# EAGLE design main (EAGLE 9.6.2)
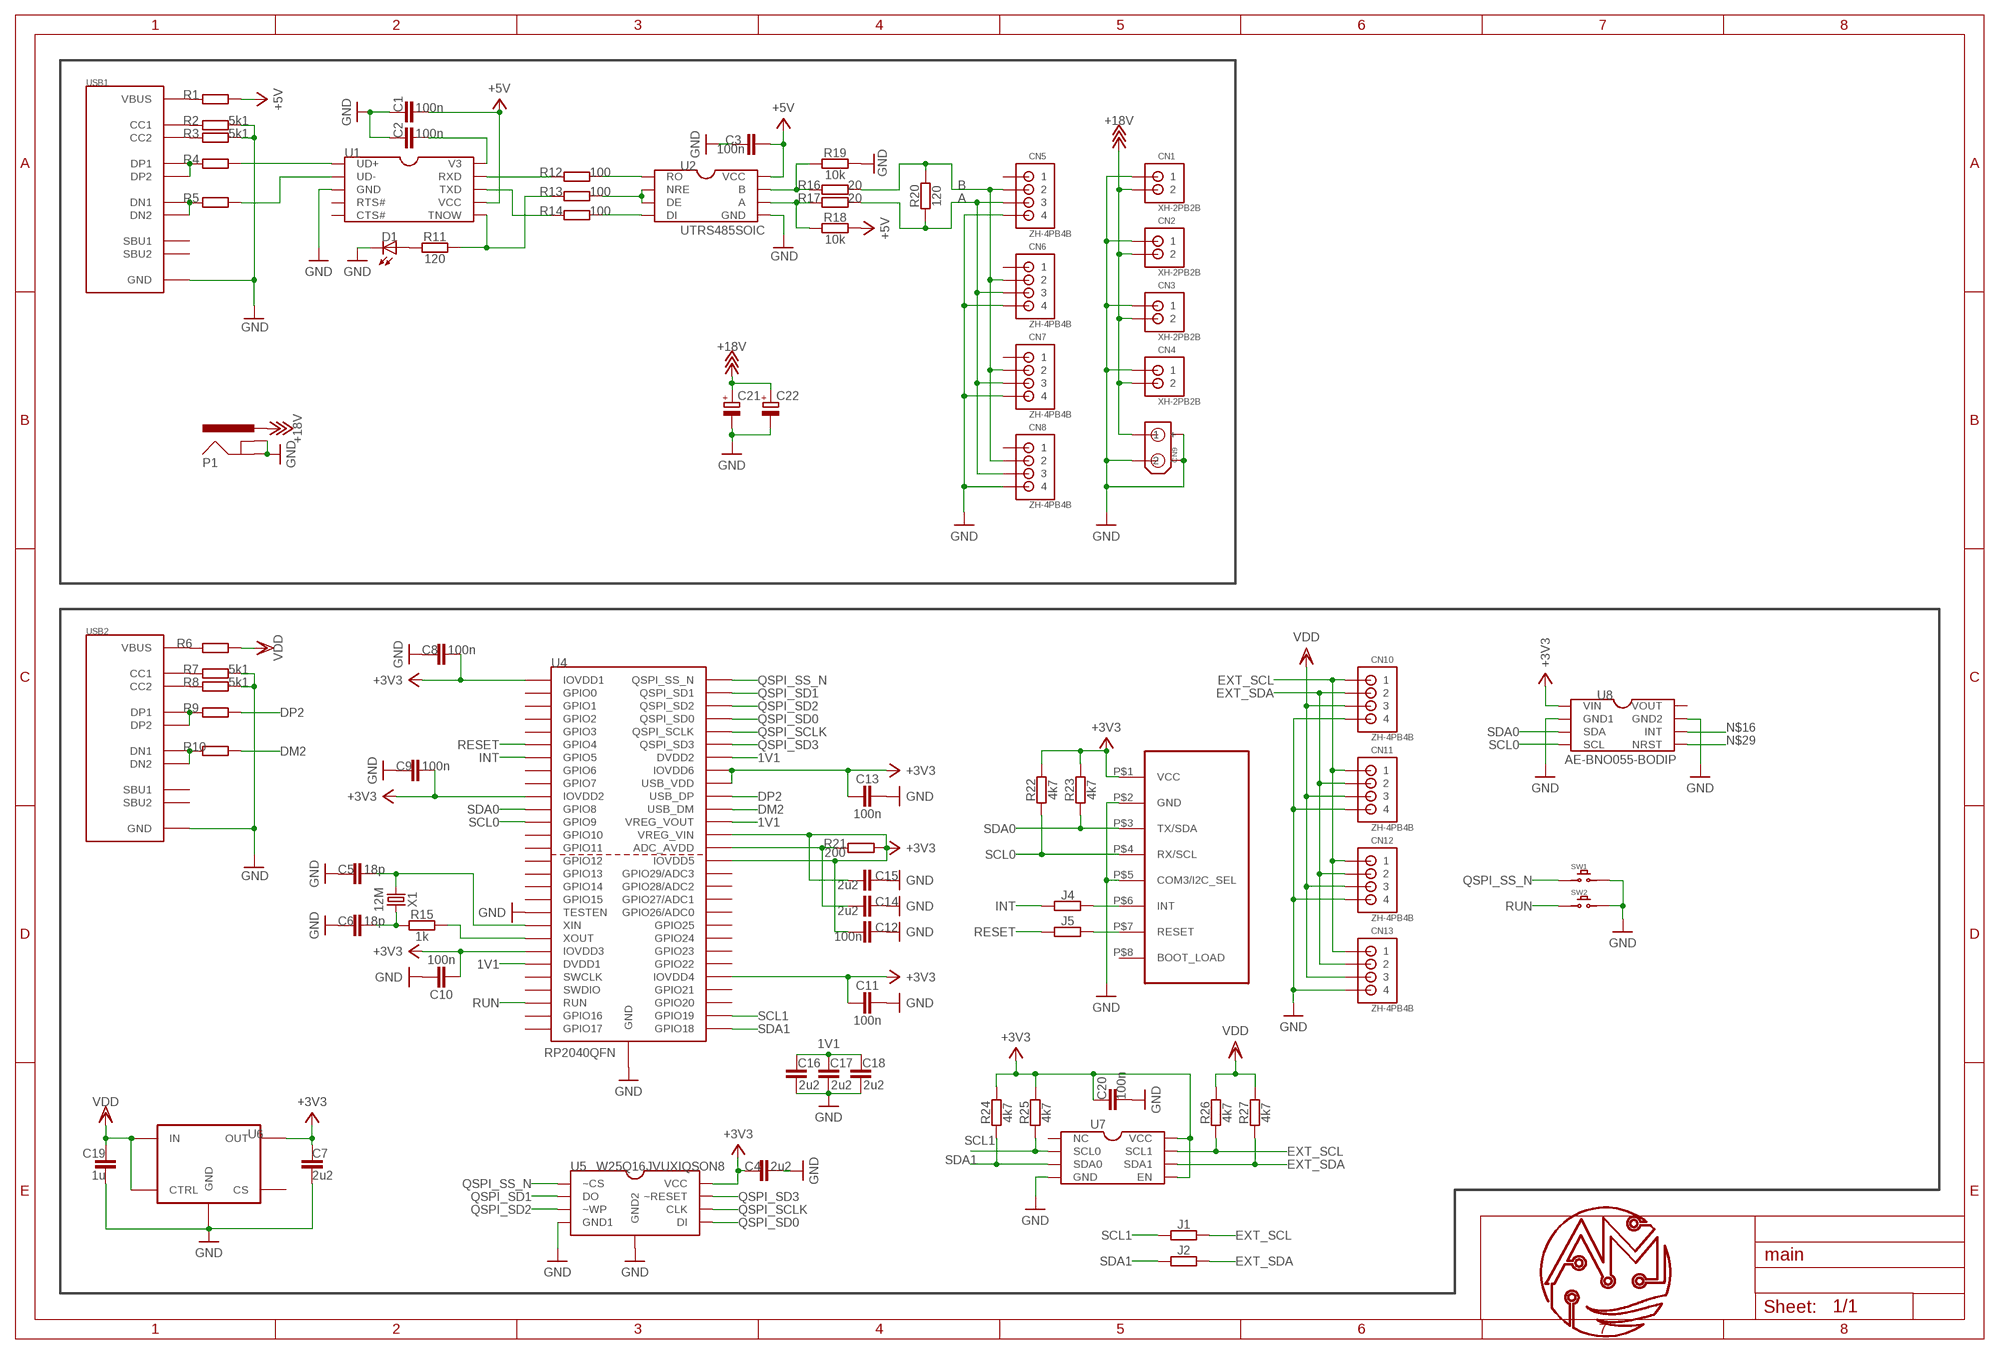
[diagram p0: schematic, sheet 1]

## Parts
C1  100n  CAPACITOR1608  [C1608]
C2  100n  CAPACITOR1608  [C1608]
C3  100n  CAPACITOR1608  [C1608]
C4  2u2  CAPACITOR1608  [C1608]
C5  18p  CAPACITOR1608  [C1608]
C6  18p  CAPACITOR1608  [C1608]
C7  2u2  CAPACITOR1608  [C1608]
C8  100n  CAPACITOR1608  [C1608]
C9  100n  CAPACITOR1608  [C1608]
C10  100n  CAPACITOR1608  [C1608]
C11  100n  CAPACITOR1608  [C1608]
C12  100n  CAPACITOR1608  [C1608]
C13  100n  CAPACITOR1608  [C1608]
C14  2u2  CAPACITOR1608  [C1608]
C15  2u2  CAPACITOR1608  [C1608]
C16  2u2  CAPACITOR1608  [C1608]
C17  2u2  CAPACITOR1608  [C1608]
C18  2u2  CAPACITOR1608  [C1608]
C19  1u  CAPACITOR1608  [C1608]
C20  100n  CAPACITOR1608  [C1608]
C21  E_CAPACITORRADIAL_D8  [ECAP-D80-L115]
C22  E_CAPACITORRADIAL_D8  [ECAP-D80-L115]
CN1  XH-2PB2B  [B2B-XH-A]
CN2  XH-2PB2B  [B2B-XH-A]
CN3  XH-2PB2B  [B2B-XH-A]
CN4  XH-2PB2B  [B2B-XH-A]
CN5  ZH-4PB4B  [B4B-ZR]
CN6  ZH-4PB4B  [B4B-ZR]
CN7  ZH-4PB4B  [B4B-ZR]
CN8  ZH-4PB4B  [B4B-ZR]
CN9  XT60PW-MPCB  [XT60PW-M]
CN10  ZH-4PB4B  [B4B-ZR]
CN11  ZH-4PB4B  [B4B-ZR]
CN12  ZH-4PB4B  [B4B-ZR]
CN13  ZH-4PB4B  [B4B-ZR]
D1  LED1608R  [LED1608R]
J1  JUMPER1608  [J1608]
J2  JUMPER1608  [J1608]
J4  JUMPER1608  [J1608]
J5  JUMPER1608  [J1608]
P1  DC-JACKMJ179PH  [MJ179PH]
R1  RESISTER3225  [R3225]
R2  5k1  RESISTER1608  [R1608]
R3  5k1  RESISTER1608  [R1608]
R4  RESISTER1608  [R1608]
R5  RESISTER1608  [R1608]
R6  RESISTER3225  [R3225]
R7  5k1  RESISTER1608  [R1608]
R8  5k1  RESISTER1608  [R1608]
R9  RESISTER1608  [R1608]
R10  RESISTER1608  [R1608]
R11  120  RESISTER1608  [R1608]
R12  100  RESISTER1608  [R1608]
R13  100  RESISTER1608  [R1608]
R14  100  RESISTER1608  [R1608]
R15  1k  RESISTER1608  [R1608]
R16  20  RESISTER1608  [R1608]
R17  20  RESISTER1608  [R1608]
R18  10k  RESISTER1608  [R1608]
R19  10k  RESISTER1608  [R1608]
R20  120  RESISTER1608  [R1608]
R21  200  RESISTER1608  [R1608]
R22  4k7  RESISTER1608  [R1608]
R23  4k7  RESISTER1608  [R1608]
R24  4k7  RESISTER1608  [R1608]
R25  4k7  RESISTER1608  [R1608]
R26  4k7  RESISTER1608  [R1608]
R27  4k7  RESISTER1608  [R1608]
SW1  TSY3420SMD-HOLE  [TSY3420-HOLE]
SW2  TSY3420SMD-HOLE  [TSY3420-HOLE]
U1  CH340EMSOP  [MSOP-05-10P]
U2  UTRS485SOIC  [SOIC-8P]
U3  CJMCU-055SIP  [CJMCU-055]
U4  RP2040QFN  [RP2040]
U5  W25Q16JVUXIQSON8  [W25Q16JVUXIQ]
U6  REGULATOR2SOT23-5P  [SOT23-5P]
U7  PCA9515SOIC  [PCA9515-SOIC]
U8  AE-BNO055-BODIP  [AE-BNO055-BO]
U$2  LOGO8MM  [LOGO-8MM]
USB1  USB-CSMD  [5077CR-16-SMC2-BK-TR]
USB2  USB-CSMD  [5077CR-16-SMC2-BK-TR]
X1  12M  XTALHC49S  [HC49S]

## Nets
1V1: C16.P$1 C17.P$1 C18.P$1 U4.P$23(DVDD1) U4.P$45(VREG_VOUT) U4.P$50(DVDD2)
+3V3: C4.P$1 C7.P$2 C8.P$2 C9.P$2 C10.P$2 C11.P$2 C12.P$2 C13.P$1 C15.P$2 C20.P$1 R21.P$2 R22.P$2 R23.P$2 R24.P$2 R25.P$2 U3.P$1(VCC) U4.P$1(IOVDD1) U4.P$10(IOVDD2) U4.P$22(IOVDD3) U4.P$33(IOVDD4) U4.P$42(IOVDD5) U4.P$44(VREG_VIN) U4.P$48(USB_VDD) U4.P$49(IOVDD6) U5.P$8(VCC) U6.P$5(OUT) U7.P$5(EN) U7.P$8(VCC) U8.P$1(VIN)
+5V: C1.P$2 C3.P$1 R1.P$2 R18.P$1 U1.P$7(VCC) U2.P$8(VCC)
+18V: C21.+ C22.+ CN1.2 CN2.2 CN3.2 CN4.2 CN9.P$1(+) P1.VCC1(PWR) P1.VCC(PWR)
A: CN5.3 CN6.3 CN7.3 CN8.3 R17.P$1 R20.P$2
B: CN5.2 CN6.2 CN7.2 CN8.2 R16.P$1 R20.P$1
DM2: R10.P$2 U4.P$46(USB_DM)
DP2: R9.P$2 U4.P$47(USB_DP)
EXT_SCL: CN10.1 CN11.1 CN12.1 CN13.1 J1.P$2 R26.P$1 U7.P$7(SCL1)
EXT_SDA: CN10.2 CN11.2 CN12.2 CN13.2 J2.P$2 R27.P$1 U7.P$6(SDA1)
GND: C1.P$1 C2.P$1 C3.P$2 C4.P$2 C5.P$1 C6.P$1 C7.P$1 C8.P$1 C9.P$1 C10.P$1 C11.P$1 C12.P$1 C13.P$2 C14.P$1 C15.P$1 C16.P$2 C17.P$2 C18.P$2 C19.P$1 C20.P$2 C21.- C22.- CN1.1 CN2.1 CN3.1 CN4.1 CN5.4 CN6.4 CN7.4 CN8.4 CN9.P$2(-) CN9.P$3(-1) CN9.P$4(-2) CN9.P$5(-1) CN9.P$6(-2) CN10.4 CN11.4 CN12.4 CN13.4 D1.P$2(K) P1.BREAK1(GNDBREAK) P1.BREAK(GNDBREAK) P1.GND P1.GND1(GND) R2.P$2 R3.P$2 R7.P$2 R8.P$2 R19.P$1 SW1.P$2 SW2.P$2 U1.P$3(GND) U2.P$5(GND) U3.P$2(GND) U3.P$5(COM3/I2C_SEL) U4.P$19(TESTEN) U4.P$57(GND) U5.P$4(GND1) U5.P$9(GND2) U6.P$2(GND) U7.P$4(GND) U8.P$2(GND1) U8.P$7(GND2) USB1.A1_B12(GND) USB1.B1_A12(GND) USB1.P$13(GND) USB1.P$14(GND) USB1.P$15(GND) USB1.P$16(GND) USB1.P$17(GND) USB1.P$18(GND) USB1.P$19(GND) USB1.P$20(GND) USB2.A1_B12(GND) USB2.B1_A12(GND) USB2.P$13(GND) USB2.P$14(GND) USB2.P$15(GND) USB2.P$16(GND) USB2.P$17(GND) USB2.P$18(GND) USB2.P$19(GND) USB2.P$20(GND)
INT: J4.P$1 U4.P$7(GPIO5)
N$1: C6.P$2 R15.P$1 X1.1
N$2: R4.P$1 USB1.A6(DP1) USB1.B6(DP2)
N$3: R5.P$1 USB1.A7(DN1) USB1.B7(DN2)
N$4: R9.P$1 USB2.A6(DP1) USB2.B6(DP2)
N$5: R10.P$1 USB2.A7(DN1) USB2.B7(DN2)
N$6: R1.P$1 USB1.A4_B9(VBUS) USB1.B4_A9(VBUS)
N$7: R7.P$1 USB2.A5(CC1)
N$8: R2.P$1 USB1.A5(CC1)
N$9: R8.P$1 USB2.B5(CC2)
N$10: R3.P$1 USB1.B5(CC2)
N$11: R6.P$1 USB2.A4_B9(VBUS) USB2.B4_A9(VBUS)
N$12: R11.P$1 R13.P$2 U1.P$6(TNOW)
N$13: D1.P$1(A) R11.P$2
N$14: R4.P$2 U1.P$1(UD+)
N$16: J4.P$2 U3.P$6(INT) U8.P$6(INT)
N$17: R5.P$2 U1.P$2(UD-)
N$18: R13.P$1 U2.P$2(NRE) U2.P$3(DE)
N$19: C2.P$2 U1.P$10(V3)
N$20: R12.P$1 U2.P$1(RO)
N$21: R14.P$1 U2.P$4(DI)
N$22: R12.P$2 U1.P$9(RXD)
N$23: R14.P$2 U1.P$8(TXD)
N$24: C5.P$2 U4.P$20(XIN) X1.2
N$25: R15.P$2 U4.P$21(XOUT)
N$26: R16.P$2 R19.P$2 U2.P$7(B)
N$27: R17.P$2 R18.P$2 U2.P$6(A)
N$28: C14.P$2 R21.P$1 U4.P$43(ADC_AVDD)
N$29: J5.P$2 U3.P$7(RESET) U8.P$5(NRST)
QSPI_SCLK: U4.P$52(QSPI_SCLK) U5.P$6(CLK)
QSPI_SD0: U4.P$53(QSPI_SD0) U5.P$5(DI)
QSPI_SD1: U4.P$55(QSPI_SD1) U5.P$2(DO)
QSPI_SD2: U4.P$54(QSPI_SD2) U5.P$3(~WP)
QSPI_SD3: U4.P$51(QSPI_SD3) U5.P$7(~RESET)
QSPI_SS_N: SW1.P$1 U4.P$56(QSPI_SS_N) U5.P$1(~CS)
RESET: J5.P$1 U4.P$6(GPIO4)
RUN: SW2.P$1 U4.P$26(RUN)
SCL0: R22.P$1 U3.P$4(RX/SCL) U4.P$12(GPIO9) U8.P$4(SCL)
SCL1: J1.P$1 R25.P$1 U4.P$30(GPIO19) U7.P$2(SCL0)
SDA0: R23.P$1 U3.P$3(TX/SDA) U4.P$11(GPIO8) U8.P$3(SDA)
SDA1: J2.P$1 R24.P$1 U4.P$29(GPIO18) U7.P$3(SDA0)
VDD: C19.P$2 CN10.3 CN11.3 CN12.3 CN13.3 R6.P$2 R26.P$2 R27.P$2 U6.P$1(IN) U6.P$3(CTRL)
Unconnected: CN5.1 CN6.1 CN7.1 CN8.1 U1.P$4(RTS#) U1.P$5(CTS#) U3.P$8(BOOT_LOAD) U4.P$2(GPIO0) U4.P$3(GPIO1) U4.P$4(GPIO2) U4.P$5(GPIO3) U4.P$8(GPIO6) U4.P$9(GPIO7) U4.P$13(GPIO10) U4.P$14(GPIO11) U4.P$15(GPIO12) U4.P$16(GPIO13) U4.P$17(GPIO14) U4.P$18(GPIO15) U4.P$24(SWCLK) U4.P$25(SWDIO) U4.P$27(GPIO16) U4.P$28(GPIO17) U4.P$31(GPIO20) U4.P$32(GPIO21) U4.P$34(GPIO22) U4.P$35(GPIO23) U4.P$36(GPIO24) U4.P$37(GPIO25) U4.P$38(GPIO26/ADC0) U4.P$39(GPIO27/ADC1) U4.P$40(GPIO28/ADC2) U4.P$41(GPIO29/ADC3) U6.P$4(CS) U7.P$1(NC) U8.P$8(VOUT) USB1.A8(SBU1) USB1.B8(SBU2) USB2.A8(SBU1) USB2.B8(SBU2)

## Library data of the parts
C1-C20 = discrete:CAPACITOR: capacitor
C21 C22 = discrete:E_CAPACITOR
CN1-CN4 = con-jst-xh:XH-2P
CN5-CN8 CN10-CN13 = con-jst-zh:ZH-4P
CN9 = con-xt:XT60PW-M
D1 = discrete:LED
J1 J2 J4 J5 = discrete:JUMPER
P1 = akizuki:DC-JACK
R1-R27 = discrete:RESISTER: resister
SW1 SW2 = bentex:TSY3420
U1 = wch:CH340E
U2 = unisonic:UTRS485
U3 = module:CJMCU-055
U4 = RaspberryPi:RP2040
U5 = winbond:W25Q16JVUXIQ
U6 = discrete:REGULATOR2
U7 = NXPSemiconductors:PCA9515
U8 = akizuki:AE-BNO055-BO
U$2 = ajisaka-manufacturing:LOGO
USB1 USB2 = con-usb:USB-C
X1 = discrete:XTAL

## Board
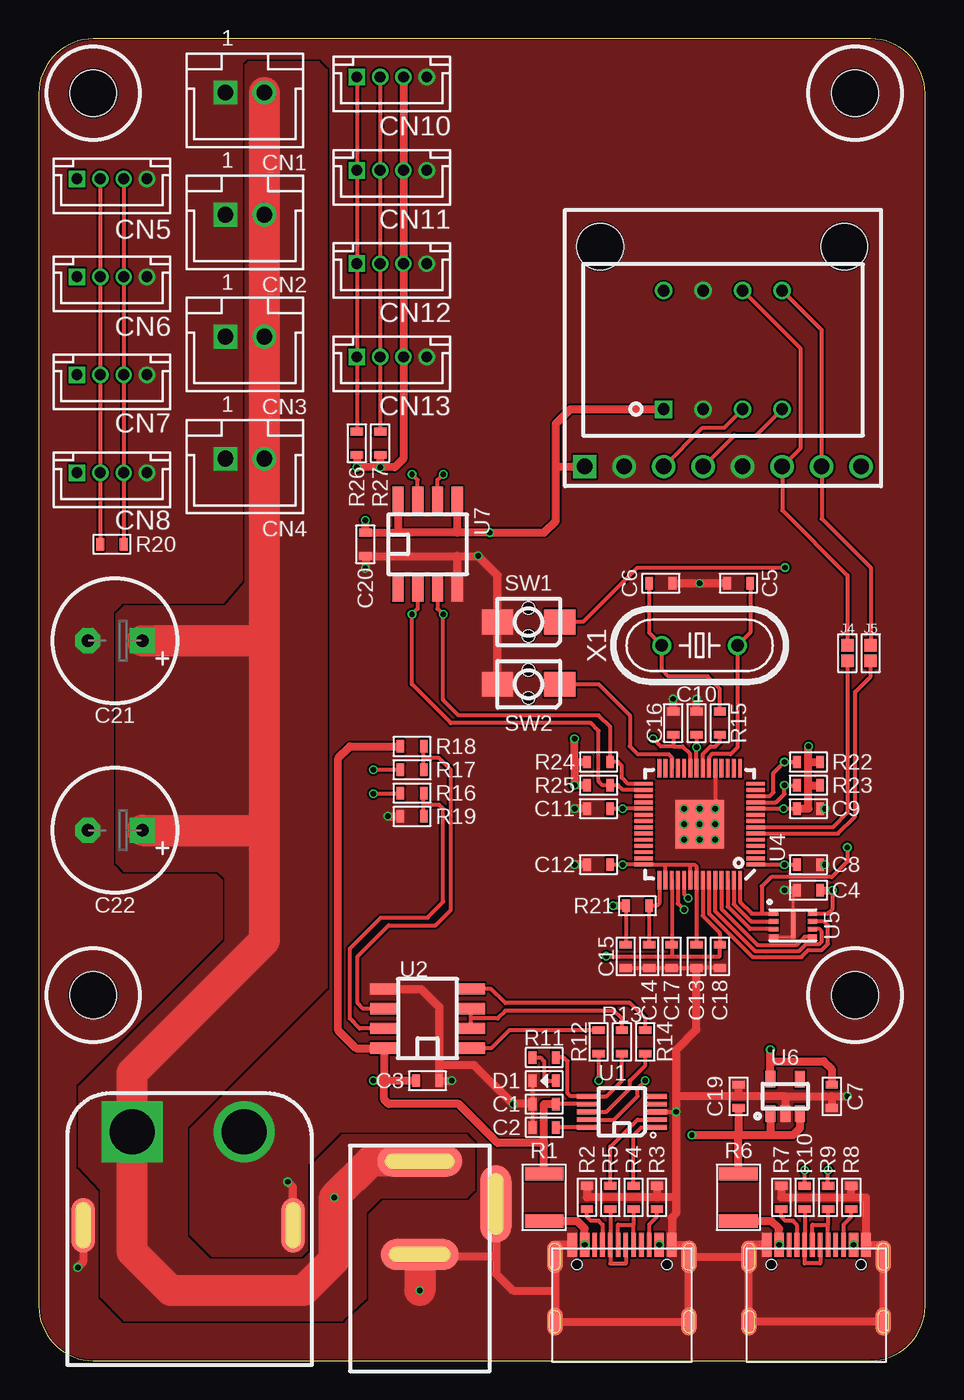
[diagram p1: board, top side]
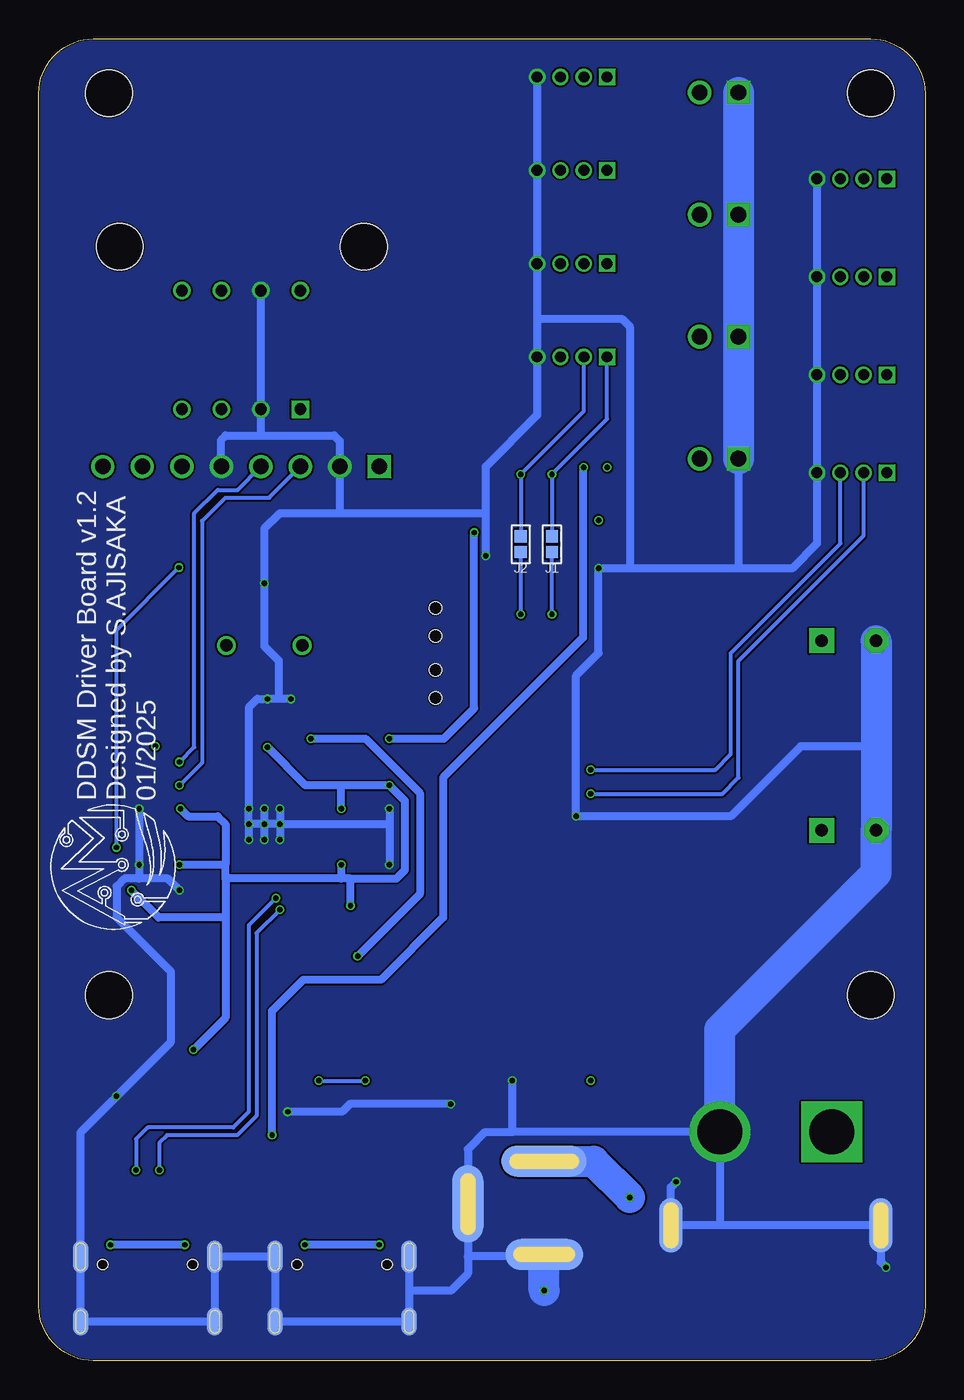
[diagram p2: board, bottom side, seen from below]

Size 57 x 85 mm. Coordinates in mm from the lower left corner, seen from the top.
Outline: 53.5,85 3.5,85 arc90 0,81.5 0,3.5 arc90 3.5,0 53.5,0 arc90 57,3.5 57,81.5 arc90 53.5,85
Copper layers (1*16): Top 0.035mm / dielectric 1.6mm / Bottom 0.035mm
Design rules "jlcpcb-2-layer *": minimum track width 3.5mil, minimum drill 0.2mm, track to track 5mil, track to pad 5mil, pad to pad 5mil, via to via 5mil, smd to smd 0mil, copper to edge 0.1mm, drill to drill 5mil, minimum pad ring 4mil, minimum via ring 4mil, stop-mask expansion 3mil, vias tented up to drill 100mil, thermal gap 10mil
Holes 3 mm at 52.5,81.5 3.5,81.5 3.5,23.5 52.5,23.5

### Footprints (pad centres in the part's own frame; a part is rotated, then mirrored left to right if it is on the bottom)
C1608 = smd 0.5 x 0.8: P$1 -0.75,0; P$2 0.75,0
ECAP-D80-L115 = drill 0.813 pad 1.6 square: + -1.75,0 | drill 0.813 pad 1.6 octagon: - 1.75,0
B2B-XH-A = drill 1.016 square: 1 -1.25,0 | drill 1.016: 2 1.25,0
B4B-ZR = drill 0.7 square: 1 -2.25,0 | drill 0.7: 2 -0.75,0; 3 0.75,0; 4 2.25,0
XT60PW-M = drill 2.9 square: P$1 3.6,0 | drill 2.9: P$2 -3.6,0 | smd 1.5 x 3.5: P$3 6.75,6; P$4 -6.75,6 | smd 1.5 x 3.5 bottom: P$5 -6.75,6; P$6 6.75,6
LED1608R = smd 0.5 x 0.8: P$1 -0.75,0; P$2 0.75,0
J1608 = smd 0.8 x 0.8: P$1 -0.5,0; P$2 0.5,0
MJ179PH = smd 5 x 2: BREAK 3.25,-4.9 | smd 5 x 2 bottom: BREAK1 3.25,-4.9 | smd 2 x 5: GND 0,0 | smd 2 x 5 bottom: GND1 0,0 | smd 2 x 5.5: VCC 6,0 | smd 2 x 5.5 bottom: VCC1 6,0
R3225 = smd 0.85 x 2.5: P$1 -1.525,0; P$2 1.525,0
R1608 = smd 0.5 x 0.8: P$1 -0.75,0; P$2 0.75,0
TSY3420-HOLE = smd 2 x 1.6: P$1 -2,0; P$2 2,0 | hole 0.8: 0,0.9; 0,-0.9
MSOP-05-10P = smd 1.35 x 0.3: P$1 -2.225,1; P$2 -2.225,0.5; P$3 -2.225,0; P$4 -2.225,-0.5; P$5 -2.225,-1; P$6 2.225,-1; P$7 2.225,-0.5; P$8 2.225,0; P$9 2.225,0.5; P$10 2.225,1
SOIC-8P = smd 0.72 x 1.8: P$1 -1.905,-2.794; P$2 -0.635,-2.794; P$3 0.635,-2.794; P$4 1.905,-2.794; P$5 1.905,2.794; P$6 0.635,2.794; P$7 -0.635,2.794; P$8 -1.905,2.794
CJMCU-055 = drill 1 square: P$1 0,8.89 | drill 1: P$2 0,6.35; P$3 0,3.81; P$4 0,1.27; P$5 0,-1.27; P$6 0,-3.81; P$7 0,-6.35; P$8 0,-8.89 | hole 3: 14.13,7.9; 14.13,-7.8
RP2040 = smd 1.2 x 0.25: P$1 -3.6,2.6; P$2 -3.6,2.2; P$3 -3.6,1.8; P$4 -3.6,1.4; P$5 -3.6,1; P$6 -3.6,0.6; P$7 -3.6,0.2; P$8 -3.6,-0.2; P$9 -3.6,-0.6; P$10 -3.6,-1; P$11 -3.6,-1.4; P$12 -3.6,-1.8; P$13 -3.6,-2.2; P$14 -3.6,-2.6; P$29 3.6,-2.6; P$30 3.6,-2.2; P$31 3.6,-1.8; P$32 3.6,-1.4; P$33 3.6,-1; P$34 3.6,-0.6; P$35 3.6,-0.2; P$36 3.6,0.2; P$37 3.6,0.6; P$38 3.6,1; P$39 3.6,1.4; P$40 3.6,1.8; P$41 3.6,2.2; P$42 3.6,2.6 | smd 0.25 x 1.2: P$15 -2.6,-3.6; P$16 -2.2,-3.6; P$17 -1.8,-3.6; P$18 -1.4,-3.6; P$19 -1,-3.6; P$20 -0.6,-3.6; P$21 -0.2,-3.6; P$22 0.2,-3.6; P$23 0.6,-3.6; P$24 1,-3.6; P$25 1.4,-3.6; P$26 1.8,-3.6; P$27 2.2,-3.6; P$28 2.6,-3.6; P$43 2.6,3.6; P$44 2.2,3.6; P$45 1.8,3.6; P$46 1.4,3.6; P$47 1,3.6; P$48 0.6,3.6; P$49 0.2,3.6; P$50 -0.2,3.6; P$51 -0.6,3.6; P$52 -1,3.6; P$53 -1.4,3.6; P$54 -1.8,3.6; P$55 -2.2,3.6; P$56 -2.6,3.6 | smd 3.1 x 3.1: P$57 0,0
W25Q16JVUXIQ = smd 0.6 x 0.3: P$1 -1.25,0.75; P$2 -1.25,0.25; P$3 -1.25,-0.25; P$4 -1.25,-0.75; P$5 1.25,-0.75; P$6 1.25,-0.25; P$7 1.25,0.25; P$8 1.25,0.75 | smd 0.3 x 1.7: P$9 0,0
SOT23-5P = smd 0.65 x 1.06: P$1 -0.95,-1.1; P$2 0,-1.1; P$3 0.95,-1.1; P$4 0.95,1.1; P$5 -0.95,1.1
PCA9515-SOIC = smd 0.72 x 1.8: P$1 -1.905,-2.794; P$2 -0.635,-2.794; P$3 0.635,-2.794; P$4 1.905,-2.794; P$5 1.905,2.794; P$6 0.635,2.794; P$7 -0.635,2.794; P$8 -1.905,2.794
AE-BNO055-BO = drill 0.75 square: P$1 -3.81,3.81 | drill 0.75: P$2 -3.81,1.27; P$3 -3.81,-1.27; P$4 -3.81,-3.81; P$5 3.81,-3.81; P$6 3.81,-1.27; P$7 3.81,1.27; P$8 3.81,3.81
5077CR-16-SMC2-BK-TR = smd 0.6 x 1.54: A1_B12 -3.2,4.95; A4_B9 -2.4,4.95; B1_A12 3.2,4.95; B4_A9 2.4,4.95 | smd 0.3 x 1.54: A5 -1.25,4.95; A6 -0.25,4.95; A7 0.25,4.95; A8 1.25,4.95; B5 1.75,4.95; B6 0.75,4.95; B7 -0.75,4.95; B8 -1.75,4.95 | smd 1 x 2.1: P$13 -4.32,4.18; P$14 4.32,4.18 | smd 1 x 1.8: P$15 -4.32,0; P$16 4.32,0 | smd 1 x 2.1 bottom: P$17 -4.32,4.18; P$18 4.32,4.18 | smd 1 x 1.8 bottom: P$19 4.32,0; P$20 -4.32,0 | hole 0.65: -2.89,3.68; 2.89,3.68
HC49S = drill 0.813: 1 -2.44,0; 2 2.44,0

### Placement (x,y rotation side)
C1  32.5,16.5 0 top
C2  32.5,15 0 top
C3  25,18 0 top
C4  49.5,30.25 180 top
C5  45,50 0 top
C6  40,50 180 top
C7  51,17 90 top
C8  49.5,31.9 180 top
C9  49.5,35.5 180 top
C10  42.3,41 270 top
C11  36,35.5 0 top
C12  36,31.9 0 top
C13  42.3,26 270 top
C14  39.25,26 90 top
C15  37.75,26 90 top
C16  40.8,41 90 top
C17  40.7,26 270 top
C18  43.8,26 270 top
C19  45,17 270 top
C20  21,52.5 270 top
C21  4.9,46.3 180 top
C22  4.9,34.1 180 top
CN1  13.25,81.55 0 top
CN2  13.25,73.7 0 top
CN3  13.25,65.85 0 top
CN4  13.25,58 0 top
CN5  4.7,76 0 top
CN6  4.7,69.7 0 top
CN7  4.7,63.4 0 top
CN8  4.7,57.1 0 top
CN9  9.6,14.71 180 top
CN10  22.7,82.55 0 top
CN11  22.7,76.55 0 top
CN12  22.7,70.55 0 top
CN13  22.7,64.55 0 top
D1  32.5,18 180 top
J1  24,52.5 90 bottom
J2  26,52.5 90 bottom
J4  52,45.5 90 top
J5  53.5,45.5 90 top
P1  24.5,6.83 90 top
R1  32.5,10.5 90 top
R2  35.25,10.5 90 top
R3  39.75,10.5 90 top
R4  38.25,10.5 90 top
R5  36.75,10.5 90 top
R6  45,10.5 90 top
R7  47.75,10.5 90 top
R8  52.25,10.5 90 top
R9  50.75,10.5 90 top
R10  49.25,10.5 90 top
R11  32.5,19.5 180 top
R12  36,20.5 270 top
R13  37.5,20.5 270 top
R14  39,20.5 270 top
R15  43.8,41 270 top
R16  24,36.5 0 top
R17  24,38 0 top
R18  24,39.5 0 top
R19  24,35 0 top
R20  4.7,52.5 0 top
R21  38.5,29.25 180 top
R22  49.5,38.5 0 top
R23  49.5,37 0 top
R24  36,38.5 180 top
R25  36,37 180 top
R26  20.45,59 270 top
R27  21.95,59 270 top
SW1  31.5,47.5 180 top
SW2  31.5,43.5 180 top
U1  37.5,16 180 top
U2  25,22 90 top
U3  44,57.5 90 top
U4  42.5,34.5 180 top
U5  48.5,28 0 top
U6  48,17 0 top
U7  25,52.5 0 top
U8  44,65 90 top
U$2  52.5,32 90 bottom
USB1  37.5,2.5 0 top
USB2  50,2.5 0 top
X1  42.5,46 0 top

### Tracks (layer width: path | path; a pad name or v marks a point on that pad's centre or on a via)
1V1  (via drill 0.35)
  Top 0.25: U4.P$45 C17.P$1 40.7,26 | U4.P$50 42.7,28.6 43.8,27.5 C18.P$1 43.8,26 40.7,26 | U4.P$23 41.9,39 41.4,39.5 40.8,39.5 | C16.P$1 40.8,39.5 | 40.8,39.5 40,39.5 v39.5,40 | v36.5,26 40.7,26
  Bottom 0.5: v39.5,40 36,40 32.5,36.5 32.5,30 v36.5,26
+3V3  (via drill 0.35)
  Top 0.25: U4.P$1 v47.95,31.9 C8.P$2 | U4.P$10 v47.9,35.5 C9.P$2 | R21.P$2 C15.P$2 | C10.P$2 v42.3,39.45 U4.P$22 | C11.P$2 v37.55,35.5 U4.P$33 | C12.P$2 v37.55,31.9 U4.P$42 40.3,31.9 | 40.3,31.9 41.9,31.9 | 41.9,31.9 42.15,31.9 42.3,31.75 U4.P$49 C13.P$1 | U4.P$48 41.9,31.9 | U4.P$44 40.3,31.9 | U5.P$8 50.75,28.75 51.05,29.05 v51.05,30.25
  Top 0.5: 47.05,19.25 50.5,19.25 51,18.75 C7.P$2 | U6.P$5 47.05,19.25 | C4.P$1 v51.05,30.25 | 47.05,19.25 v47.05,20 | U7.P$8 23.09,53.25 | U7.P$5 26.91,53.25 | 26.91,53.25 23.09,53.25 | C9.P$2 49.5,35.5 49.5,37 | 49.5,37 49.5,38.5 | 49.5,38.5 v49.5,39.5 | 49.5,38.5 R22.P$2 | 49.5,37 R23.P$2 | 23.09,53.25 C20.P$1 v21,54.05 | 26.91,53.25 v29,53.25 32.5,53.25 33.25,54 33.25,57.5 | R25.P$2 v34.45,37 34.45,38.5 | R21.P$2 v36.95,29.25 | 34.45,38.5 v34.45,40 | 34.45,38.5 R24.P$2 | 33.25,57.5 U3.P$1 | U8.P$1 34.19,61.19 33.25,60.25 33.25,57.5
  Bottom 0.5: 45,31 45,28.5 | 45,28.5 45,22.05 v47.05,20 | v36.95,29.25 36.95,31 | 36.95,31 37.55,31 | 37.55,31 45,31 | 36.95,31 34,31 33.45,31.55 33.45,36 v34.45,37 37.55,37 | 45,28.5 49.3,28.5 v51.05,30.25 | v34.45,40 30.95,40 29,41.95 v29,53.25 | 45,31 45,31.9 | v47.9,35.5 47.4,35 45.5,35 45,34.5 45,31.9 | 37.55,37 39.85,37 v42.3,39.45 | v37.55,35.5 37.55,37 | v37.55,31.9 37.55,31 | v47.95,31.9 45,31.9
+5V  (via drill 0.35)
  Top 0.25: U1.P$7 C1.P$2
  Top 0.5: R1.P$2 32.5,14 | 32.5,14 32.5,16.5 C1.P$2 | 22.21,18 U2.P$8 20.41,20.09 19.25,21.25 19.25,38.75 20,39.5 R18.P$1 | C3.P$1 22.21,18 | 22.21,18 v21.5,18 | 22.21,18 22.21,16.79 22.5,16.5 27,16.5 29.5,14 32.5,14
+18V  (via drill 0.35)
  Top 2: CN1.2 CN2.2 CN3.2 CN4.2 14.5,46.3 | 14.5,46.3 14.5,34.1 | 14.5,34.1 14.5,27 6,18.5 CN9.P$1 6,7 8.5,4.5 17,4.5 19,6.5 v19,10.5 21.32,12.82 P1.VCC1 | C22.+ 14.5,34.1 | C21.+ 14.5,46.3
  Bottom 2: P1.VCC1 21.32,12.82 v19,10.5
  pour Top (no thermals): 12,27 12,31 11.5,31.5 5.5,31.5 5,32 5,48 5.5,48.5 12,48.5 13.3,50 13.3,83.3 13.5,83.5 18,83.5 18.5,83 18.5,24 9.5,15 9.5,8 11,6.5 17,6.5 17.5,7 17.5,12.5 19.5,14.5 27.5,14.5 28,14 28,11 27.5,10.5 22,10.5 21,9.5 21,4 19.5,2.6 5.5,2.6 4,4.1 4,11 2.6,12.5 2.6,17.6
A  (via drill 0.35)
  Top 0.25: CN5.3 CN6.3 CN7.3 CN8.3 R20.P$2 | R17.P$1 v21.5,38
  Bottom 0.25: v21.5,38 13.5,38 12.5,39 12.5,45.5 5.45,52.55 CN8.3
B  (via drill 0.35)
  Top 0.25: CN5.2 CN6.2 CN7.2 CN8.2 R20.P$1 | R16.P$1 23.2,36.45 v21.5,36.45
  Bottom 0.25: v21.5,36.45 13.05,36.45 12,37.5 12,45 3.95,53.05 CN8.2
DM2  (via drill 0.35)
  Top 0.25: R10.P$2 v49.25,12.25 | U4.P$46 41.1,29.4 v41.5,29
  Bottom 0.25: v41.5,29 43,27.5 43,15.75 44.25,14.5 48.75,14.5 49.25,14 v49.25,12.25
DP2  (via drill 0.35)
  Top 0.25: R9.P$2 v50.75,12.25 | U4.P$47 41.5,30 v41.75,29.75
  Bottom 0.25: v41.75,29.75 43.5,28 43.5,16 44.5,15 50,15 50.75,14.25 v50.75,12.25
EXT_SCL  (via drill 0.35)
  Top 0.25: CN10.1 CN11.1 CN12.1 CN13.1 R26.P$1 | U7.P$7 24.36,56.63 v24,57
  Bottom 0.25: J1.P$2 v24,57 20.45,60.55 CN13.1
EXT_SDA  (via drill 0.35)
  Top 0.25: CN10.2 CN11.2 CN12.2 CN13.2 R27.P$1 | U7.P$6 25.64,56.63 v26,57
  Bottom 0.25: J2.P$2 v26,57 21.95,61.05 CN13.2
GND  (via drill 0.35)
  Top 0.15: v42.5,35.5 v41.5,35.5 | v42.5,33.5 v43.5,33.5
  Top 0.2: U5.P$4 48.5,27.25 U5.P$9 48.5,30 C4.P$2
  Top 0.25: C2.P$1 C1.P$1 D1.P$2 | U1.P$3 v41,16 | C18.P$2 C13.P$2 C17.P$2 C14.P$1 C15.P$1 | U4.P$19 v43.5,35.5
  Top 0.5: 41,10.5 39.75,10.5 | 39.75,10.5 35.25,10.5 R2.P$2 | R7.P$2 47.75,10.5 52.25,10.5 | 52.25,10.5 R8.P$2 | 52.25,10.5 53.2,10.5 USB2.B1_A12 54.32,7.45 USB2.P$18 USB2.P$16 USB2.P$20 USB2.P$17 | 41,10.5 41,9.5 40.7,9.2 USB1.B1_A12 41.82,7.45 USB1.P$18 | 41,10.5 v41,16 41,17 | U2.P$5 24.59,23.91 25.75,22.75 25.75,19 | 25.75,19 C3.P$2 v26.55,18 | C1.P$1 v30.5,16.5 28,19 25.75,19 | USB1.P$18 USB2.P$17 | C19.P$1 45,17 | 48,17 45,17 | 48,17 U6.P$2 | 48,17 51,17 | 51,17 C7.P$1 | 41,17 41,20 42.3,21.3 C13.P$2 | 45,17 41,17 | R3.P$2 39.75,10.5 | 26.91,51.75 U7.P$4 | C9.P$1 v50.55,35.5 | C4.P$2 v47.95,30.25 | C12.P$1 v34.45,31.9 | C11.P$1 v34.45,35.5 | C16.P$2 v40.8,42.55 | C10.P$1 v42.3,42.55 | 26.91,51.75 C20.P$2 v21,50.95 | 26.91,51.75 v28.25,51.75 29.5,50.5 SW1.P$2 SW2.P$2 | 51,17 v52,17 | 33.18,4.5 USB1.P$17 33.18,7.45 USB1.A1_B12 | 33.18,4.5 USB1.P$20 USB1.P$16 USB1.P$18 | v22.45,35 R19.P$1 | C8.P$1 v50.55,31.9 | 29.4,6.7 24.5,6.7 P1.GND1 | 29.4,6.7 29.4,5.6 30.5,4.5 33.18,4.5 | CN9.P$6 2.85,6.35 v2.5,6 | CN9.P$5 16.35,11.15 v16,11.5 | C6.P$1 v42.5,50 C5.P$1 | P1.BREAK 29.4,6.7 | USB2.A1_B12 45.68,7.45 USB2.P$17
  Top 2: P1.GND1 v24.5,4.5
  Bottom 0.5: CN10.4 CN11.4 CN12.4 24.95,67 | v34.45,35.5 34.45,34.5 | 34.45,34.5 v34.45,31.9 | v40.8,42.55 41.55,42.55 | 41.55,42.55 v42.3,42.55 42.95,42.55 43.5,42 v43.5,35.5 v43.5,34.5 | v47.95,30.25 48.7,31 50.55,31 | v41.5,34.5 34.45,34.5 | v41.5,34.5 U4.P$57 | U4.P$57 v43.5,34.5 | v42.5,35.5 U4.P$57 | U4.P$57 v42.5,33.5 | v41.5,35.5 v41.5,34.5 | v41.5,34.5 v41.5,33.5 | v43.5,34.5 v43.5,33.5 | 41.55,42.55 41.55,45 42.5,45.95 v42.5,50 42.5,53.5 41.5,54.5 37.65,54.5 | v28.25,51.75 28.25,54.5 | 28.25,54.5 28.25,55 | 28.25,57.5 24.95,60.8 CN13.4 24.95,67 | v30.5,16.5 37,16.5 37.5,16 v41,16 | 50.55,31 51.5,31 52,30.5 52,28.5 48.5,25 48.5,20.5 v52,17 54.32,14.68 USB2.P$18 USB2.P$16 USB2.P$20 USB2.P$17 USB1.P$18 USB1.P$16 USB1.P$20 33.18,4.5 | 50.55,31 v50.55,31.9 v50.55,35.5 | CN5.4 CN6.4 CN7.4 CN8.4 6.95,52.55 8.55,50.95 12,50.95 | USB1.P$17 33.18,4.5 | 26.55,14.71 CN9.P$2 13.2,8.71 CN9.P$5 | 26.55,14.71 v26.55,18 | CN4.1 12,50.95 | 12,50.95 19,50.95 | 19,50.95 v21,50.95 21,45.5 22.45,44.05 v22.45,35 12.5,35 8,39.5 3.15,39.5 | 37.65,54.5 U3.P$2 37.65,59.15 38,59.5 42.7,59.5 | 37.65,54.5 28.25,54.5 | U3.P$5 45.27,59.23 45,59.5 42.7,59.5 | 29.4,6.7 24.5,6.7 P1.GND1 | 29.4,6.7 29.4,5.6 30.5,4.5 33.18,4.5 | CN9.P$5 CN9.P$6 2.85,6.35 v2.5,6 | CN9.P$5 16.35,11.15 v16,11.5 | U8.P$7 U8.P$2 42.73,59.53 42.7,59.5 | 26.55,14.71 28.29,14.71 29.4,13.6 P1.BREAK 29.4,6.7 | 24.95,67 19.5,67 19,66.5 19,50.95
  Bottom 0.508: 28.25,55 28.25,57.5
  Bottom 2: CN1.1 CN2.1 CN3.1 CN4.1 | C21.- 3.15,39.5 C22.- 3.15,31.35 13.2,21.3 CN9.P$2 | v24.5,4.5 24.5,6.7
  other vias: 42.5,34.5
  pour Bottom (no thermals): -0.5,85.5 57.5,85.5 57.5,-0.5 -0.5,-0.5
  pour Top (rank 2, no thermals): -1,86 58,86 58,-1 -1,-1
INT
  Top 0.25: J4.P$1 52,35.25 51.05,34.3 U4.P$7
N$1
  Top 0.25: C6.P$2 39.25,46.81 X1.1 40.06,44.44 40.5,44 43,44 43.8,43.2 R15.P$1
N$2
  Top 0.25: R4.P$1 38.25,8.75 | 38.25,8.75 37.25,8.75 USB1.A6 | USB1.B6 38.25,8.75
N$3
  Top 0.25: USB1.A7 37.75,6.25 36.75,6.25 USB1.B7 R5.P$1
N$4
  Top 0.25: R9.P$1 50.75,8.75 | 50.75,8.75 49.75,8.75 USB2.A6 | USB2.B6 50.75,8.75
N$5
  Top 0.25: USB2.A7 50.25,6.25 49.25,6.25 USB2.B7 R10.P$1
N$6  (via drill 0.35)
  Top 0.5: USB1.A4_B9 35.1,8.5 34.62,8.97 R1.P$1
  Bottom 0.5: USB1.A4_B9 USB1.B4_A9
  other vias: 35.1,7.45 39.9,7.45
N$7
  Top 0.25: R7.P$1 47.75,9.25 48,9 48.5,9 48.75,8.75 USB2.A5
N$8
  Top 0.25: R2.P$1 35.25,9.25 35.5,9 36,9 36.25,8.75 USB1.A5
N$9
  Top 0.25: R8.P$1 52.25,9.25 51.75,8.75 USB2.B5
N$10
  Top 0.25: R3.P$1 39.75,9.25 39.25,8.75 USB1.B5
N$11  (via drill 0.35)
  Top 0.5: USB2.A4_B9 47.6,8.5 47.12,8.97 R6.P$1
  Bottom 0.5: USB2.A4_B9 USB2.B4_A9
  other vias: 47.6,7.45 52.4,7.45
N$12
  Top 0.25: R13.P$2 37.5,18 36.5,17 U1.P$6 34.2,17 34,17.2 34,19.25 33.75,19.5 R11.P$1
N$13
  Top 0.25: R11.P$2 32.25,19.5 32.5,19.25 32.5,18.25 32.75,18 D1.P$1
N$14
  Top 0.25: R4.P$2 38.25,14.5 38.75,15 U1.P$1
N$16
  Top 0.25: J4.P$2 52,50.5 47.81,54.69 U3.P$6 49,58.69 49,65.08 U8.P$6
N$17
  Top 0.25: R5.P$2 36.75,13.75 38.5,15.5 U1.P$2
N$18
  Top 0.25: U2.P$2 27.79,22 | 27.79,22 U2.P$3 | R13.P$1 37.5,22 37,22.5 30,22.5 29.5,22 27.79,22
N$19
  Top 0.25: U1.P$10 C2.P$2
N$20
  Top 0.25: R12.P$1 30.25,21.25 29.09,20.09 U2.P$1
N$21
  Top 0.25: R14.P$1 39,22 38,23 30,23 29.09,23.91 U2.P$4
N$22  (via drill 0.35)
  Top 0.25: v39,18 38.5,17.5 38.5,17 37,15.5 U1.P$9 | R12.P$2 v36,18
  Bottom 0.25: v39,18 v36,18
N$23
  Top 0.25: U1.P$8 36.5,16 38,17.5 38,18 39,19 R14.P$2
N$24
  Top 0.25: C5.P$2 45.75,46.81 X1.2 44.94,39.44 44.5,39 43.3,39 43.1,38.8 U4.P$20
N$25
  Top 0.25: R15.P$2 43.8,39.8 43.5,39.5 43.2,39.5 42.7,39 U4.P$21
N$26
  Top 0.25: R19.P$2 24.75,35.75 | 24.75,35.75 R16.P$2 | U2.P$7 20.64,21.36 20,22 20,26.5 22,28.5 25,28.5 26,29.5 26,35.5 25.75,35.75 24.75,35.75
N$27
  Top 0.25: R17.P$2 24.75,38.75 | 24.75,38.75 R18.P$2 | U2.P$6 20.86,22.64 20.5,23 20.5,26 22.5,28 25.5,28 26.5,29 26.5,38 25.75,38.75 24.75,38.75
N$28
  Top 0.25: C14.P$2 R21.P$1 39.75,29.25 39.9,29.4 U4.P$43
N$29
  Top 0.25: J5.P$2 53.5,51 50.35,54.15 U3.P$7 50.35,66.27 U8.P$5
QSPI_SCLK
  Top 0.25: U5.P$6 50.2,27.75 50.35,27.6 50.35,26.95 50.2,26.8 49.35,26.8 48.9,26.35 46.05,26.35 43.5,28.9 U4.P$52
QSPI_SD0
  Top 0.25: U5.P$5 49.25,27.25 48.75,26.75 46.2,26.75 43.9,29.05 U4.P$53
QSPI_SD1
  Top 0.25: U4.P$55 44.7,29.35 45.8,28.25 U5.P$2
QSPI_SD2
  Top 0.25: U5.P$3 45.75,27.75 44.3,29.2 U4.P$54
QSPI_SD3
  Top 0.25: U5.P$7 50.5,28.25 50.75,28 50.75,26.8 50.35,26.4 49.5,26.4 49.05,25.95 45.9,25.95 43.1,28.75 U4.P$51
QSPI_SS_N  (via drill 0.35)
  Top 0.25: 46.5,28.75 45.85,28.75 45.1,29.5 U4.P$56 | 46.5,28.75 U5.P$1 | v52,33 52,32.1 51,31.1 47.1,31.1 46.5,30.5 46.5,28.75 | SW1.P$1 35,47.5 38.5,51 v48,51
  Bottom 0.25: v52,33 52,47 v48,51
RESET
  Top 0.25: U4.P$6 51.4,33.9 52.5,35 52.5,43 53.5,44 J5.P$1
RUN
  Top 0.25: SW2.P$1 36,43.5 38,41.5 38,39.5 38.5,39 40.5,39 40.7,38.8 U4.P$26
SCL0  (via drill 0.35)
  Top 0.25: U4.P$12 47,36.3 47.25,36.55 47.25,37.8 v47.95,38.5 R22.P$1 | U3.P$4 44.73,59.5 46.12,59.5 U8.P$4
  Bottom 0.25: v47.95,38.5 47,39.45 47,54.5 45.5,56 44.23,56 U3.P$4
SCL1  (via drill 0.35)
  Top 0.25: U7.P$2 24.36,48.37 v24,48 24,43.5 26.5,41 35.5,41 36,40.5 36,37.25 36.25,37 R25.P$1 37.25,37 37.55,36.7 U4.P$30
  Bottom 0.25: v24,48 J1.P$1
SDA0  (via drill 0.35)
  Top 0.25: U4.P$11 47.4,35.9 47.95,36.45 v47.95,37 R23.P$1 | U3.P$3 42.69,60 44.08,60 U8.P$3
  Bottom 0.25: v47.95,37 46.5,38.45 46.5,54 45,55.5 42.19,55.5 U3.P$3
SDA1  (via drill 0.35)
  Top 0.25: U7.P$3 25.64,48.37 v26,48 26,42.5 27,41.5 36,41.5 36.75,40.75 R24.P$1 37.25,38.5 37.5,38.25 37.5,37.5 37.9,37.1 U4.P$29
  Bottom 0.25: v26,48 J2.P$1
VDD  (via drill 0.35)
  Top 0.5: U6.P$3 48.95,14.95 48.5,14.5 47.05,14.5 | C19.P$2 45,14.5 | 47.05,14.5 45,14.5 | U6.P$1 47.05,14.5 | R6.P$2 45,14.5 | CN10.3 CN11.3 CN12.3 CN13.3 23.45,58 22.9,57.45 v21.95,57.45 | R26.P$2 v20.45,57.45 v21.95,57.45 | R27.P$2 v21.95,57.45 | 45,14.5 v42,14.5
  Bottom 0.5: v42,14.5 42,22.5 40,24.5 35,24.5 31,28.5 31,37.5 22,46.5 22,57.45 v21.95,57.45

### Text on the board
bNames: DDSM Driver Board v1.2 / Designed by S.AJISAKA / 01/2025